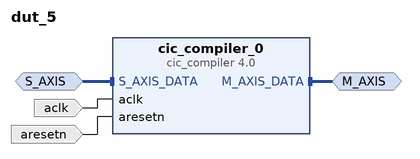
[diagram p0: block diagram of the top level]
# Vivado block design dut_5, Vivado 2015.4
create_bd_design dut_5

create_bd_intf_port -mode Slave -vlnv xilinx.com:interface:axis_rtl:1.0 S_AXIS
set_property -dict [list \
  CONFIG.TDATA_NUM_BYTES 4 \
  CONFIG.TDEST_WIDTH 0 \
  CONFIG.TID_WIDTH 0 \
  CONFIG.TUSER_WIDTH 0 \
  CONFIG.HAS_TREADY 1 \
  CONFIG.HAS_TSTRB 0 \
  CONFIG.HAS_TKEEP 0 \
  CONFIG.HAS_TLAST 0 \
  CONFIG.FREQ_HZ 100000000 \
  CONFIG.PHASE 0.000 \
  CONFIG.LAYERED_METADATA undef \
] [get_bd_intf_ports S_AXIS]
create_bd_intf_port -mode Master -vlnv xilinx.com:interface:axis_rtl:1.0 M_AXIS
create_bd_port -dir I -type clk aclk
create_bd_port -dir I -type rst aresetn

create_bd_cell -type ip -vlnv xilinx.com:ip:cic_compiler:4.0 cic_compiler_0
set_property -dict [list \
  CONFIG.Filter_Type Decimation \
  CONFIG.Fixed_Or_Initial_Rate 16 \
  CONFIG.Minimum_Rate 16 \
  CONFIG.Maximum_Rate 16 \
  CONFIG.Input_Sample_Frequency 125 \
  CONFIG.Clock_Frequency 125 \
  CONFIG.SamplePeriod 1 \
  CONFIG.Input_Data_Width 32 \
  CONFIG.Quantization Truncation \
  CONFIG.Output_Data_Width 32 \
  CONFIG.HAS_ARESETN true \
  CONFIG.HAS_DOUT_TREADY false \
] [get_bd_cells cic_compiler_0]

# ---- connections ----

connect_bd_intf_net [get_bd_intf_ports S_AXIS] [get_bd_intf_pins cic_compiler_0/S_AXIS_DATA]
connect_bd_intf_net [get_bd_intf_ports M_AXIS] [get_bd_intf_pins cic_compiler_0/M_AXIS_DATA]
connect_bd_net [get_bd_ports aclk] [get_bd_pins cic_compiler_0/aclk]
connect_bd_net [get_bd_ports aresetn] [get_bd_pins cic_compiler_0/aresetn]

validate_bd_design
save_bd_design
